# Altium schematic sheet uMultimeter_ExpDev_Sch.SchDoc: MicroMultimeter_ExpGPIO
size 127 x 101 mm; Author: Hom; CompanyName: KitSprout; DrawnBy: Hom; Engineer: Hom; Organization: KitSprout; Revision: A; SheetNumber: 1; SheetTotal: 1; License: CC BY-SA 4.0; Version: 2.0; LibVersion: 2.0; PageSetup: Record=PageOptions|CenterHorizontal=True|CenterVertical=True|PrintScale=1.00|XCorrection=1.00|YCorrection=1.00|PrintKind=0|BorderSize=5000000|LeftOffset=0|BottomOffset=0|Orientation=2|PaperLength=1000|PaperWidth=1000|Scale=100|PaperSource=7|PrintQuality=-3|MediaType=1|DitherType=10|PrintScaleMode=0|PaperKind=A4|PaperIndex=9
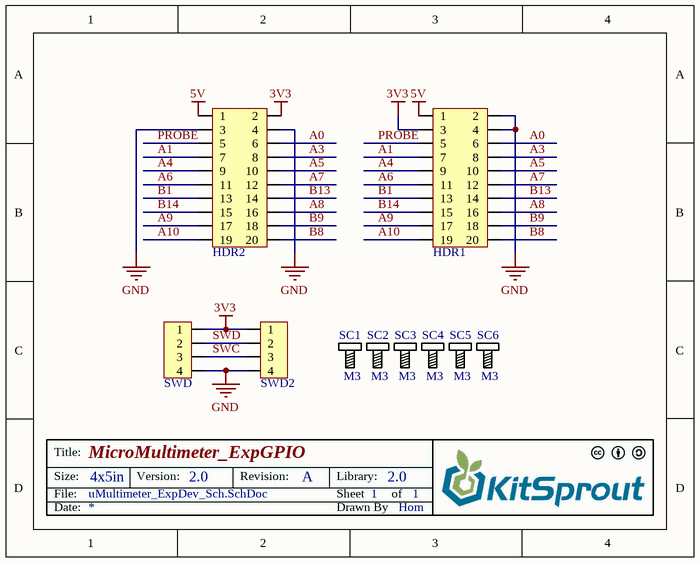
[diagram p0: uMultimeter_ExpDev_Sch.SchDoc]

## Parts
HDR1  HDR2x10_2.54  [HDR2X10_2.54_90]  (value not drawn)
HDR2  HDR2x10_2.54  [HDR2X10_2.54_180]  (value not drawn)
SC1  M3  [SCRREW_M3]
SC2  M3  [SCRREW_M3]
SC3  M3  [SCRREW_M3]
SC4  M3  [SCRREW_M3]
SC5  M3  [SCRREW_M3]
SC6  M3  [SCRREW_M3]
SWD  HDR1x4_1.27T  [HDR1X4_1.27_180]  (value not drawn)
SWD2  HDR1x4_2.54  [HDR1X4_2.54_90F]  (value not drawn)

## Nets
3V3: HDR1.3 HDR2.2 SWD.1 SWD2.1
5V: HDR1.1 HDR2.1
GND: HDR1.2 HDR1.4 HDR2.3 HDR2.4 SWD.4 SWD2.4
A0: HDR1.6 HDR2.6
A1: HDR1.7 HDR2.7
A3: HDR1.8 HDR2.8
A4: HDR1.9 HDR2.9
A5: HDR1.10 HDR2.10
A6: HDR1.11 HDR2.11
A7: HDR1.12 HDR2.12
A8: HDR1.16 HDR2.16
A9: HDR1.17 HDR2.17
A10: HDR1.19 HDR2.19
B1: HDR1.13 HDR2.13
B8: HDR1.20 HDR2.20
B9: HDR1.18 HDR2.18
B13: HDR1.14 HDR2.14
B14: HDR1.15 HDR2.15
PROBE: HDR1.5 HDR2.5
SWC: SWD.3 SWD2.3
SWD: SWD.2 SWD2.2

## Notes on the sheet
- Title:
- Size:
- Date:
- File:
- 4x5in
- Version:
- Revision:
- Sheet
- Drawn By
- Library:
- of

## Library data of the parts
HDR1 HDR2 = HDR2x10_2.54: Header
SC1-SC6 = Screw_M3: Screw
SWD = HDR1x4_1.27T: Header
SWD2 = HDR1x4_2.54: Header